# EAGLE design MRCS-RJ45-CMRI (EAGLE 7.7.0)
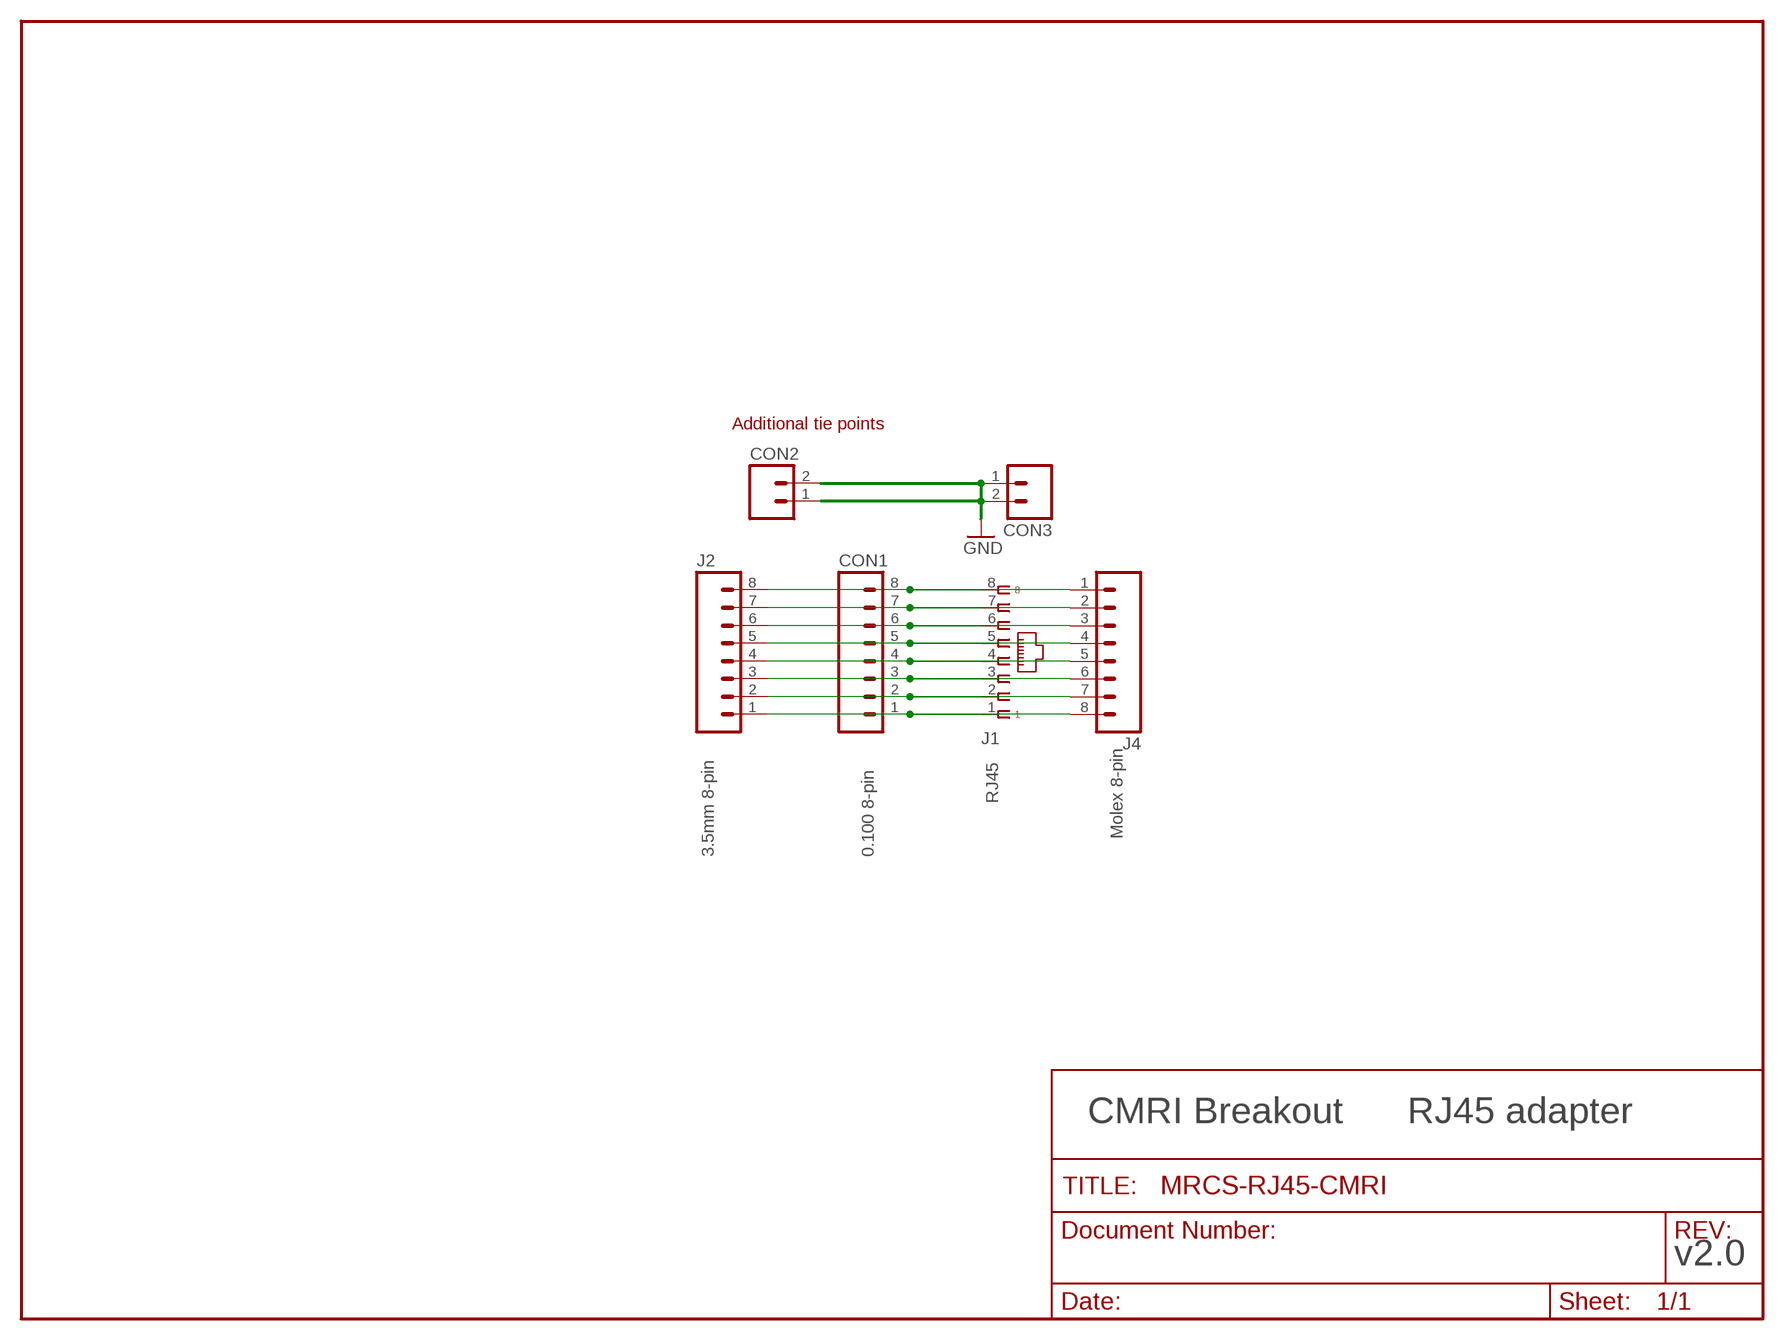
[diagram p0: schematic, sheet 1]

## Parts
CON1  CONNECTOR-M08LOCK  [1X08_LOCK]
CON2  CONNECTOR-M023.5MM-LOCK  [SCREWTERMINAL-3.5MM-2_LOCK]
CON3  CONNECTOR-M023.5MM-LOCK  [SCREWTERMINAL-3.5MM-2_LOCK]
J1  CONNECTOR-RJ45-FRONT  [RJ45-NO-SHIELD]
J2  CONNECTOR-M083.5MM-8  [SCREWTERMINAL-3.5MM-8]
J4  CONNECTOR-M081.56-F  [KK-156-8-F]

## Nets
GND: CON2.1(A) CON2.2(B) CON3.1(A) CON3.2(B)
L1: CON1.1 J1.1 J2.1 J4.8
L2: CON1.2 J1.2 J2.2 J4.7
L3: CON1.3 J1.3 J2.3 J4.6
L4: CON1.4 J1.4 J2.4 J4.5
L5: CON1.5 J1.5 J2.5 J4.4
L6: CON1.6 J1.6 J2.6 J4.3
L7: CON1.7 J1.7 J2.7 J4.2
L8: CON1.8 J1.8 J2.8 J4.1

## Notes on the sheet
- Additional tie points
- RJ45
- Molex 8-pin
- 3.5mm 8-pin | 0.100 8-pin
- CMRI Breakout | RJ45 adapter
- v2.0

## Library data of the parts
CON1 J2 J4 = SPCoast:CONNECTOR-M08: Header 8 Standard 8-pin 0.1" header. Use with straight break away headers (SKU : PRT-00116), right angle break away headers (PRT-00553), swiss pins (PRT-00743), machine pins (PRT-00117), and female headers (PRT-00115).
CON2 CON3 = SPCoast:CONNECTOR-M02: PHOENIX CONNECTOR
J1 = SPCoast:CONNECTOR-RJ45: Tyco CORCOM Modular RJ Jacks No Shield; AMP: 520151-4; OPL: none

## Net classes
0 default: width 0.508 mm

## Board
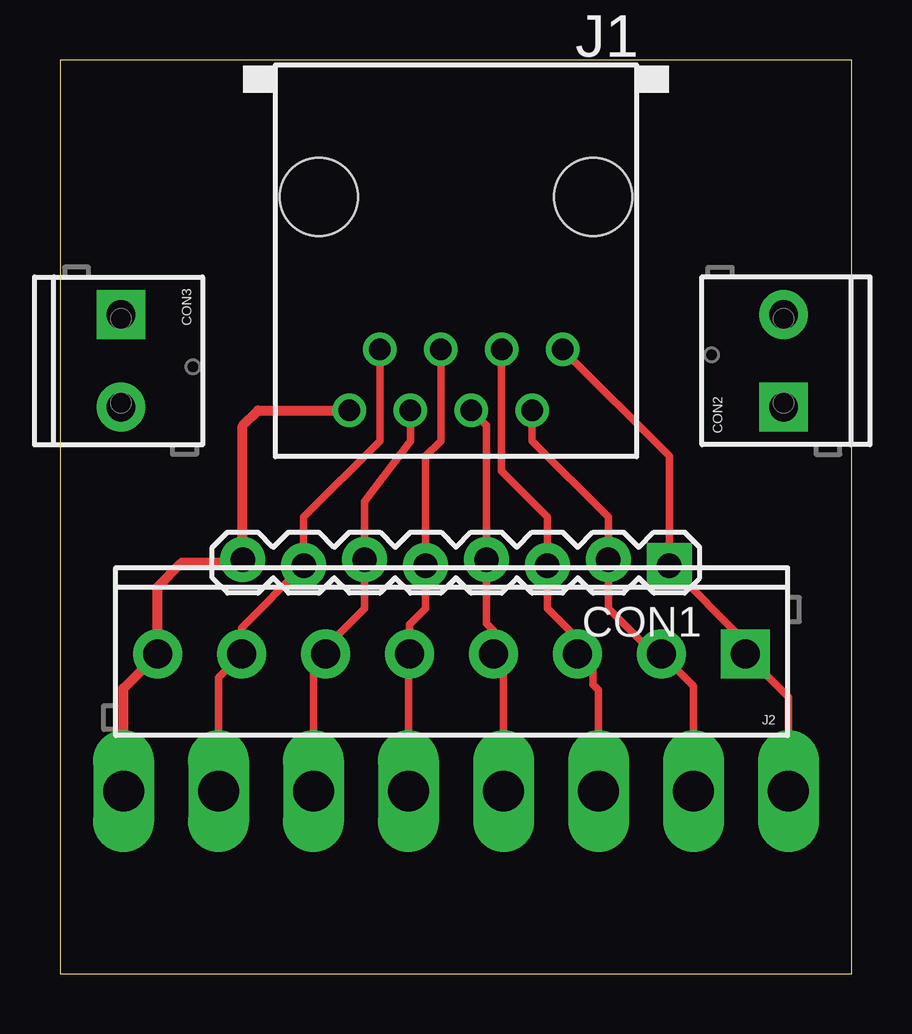
[diagram p1: board, top side]
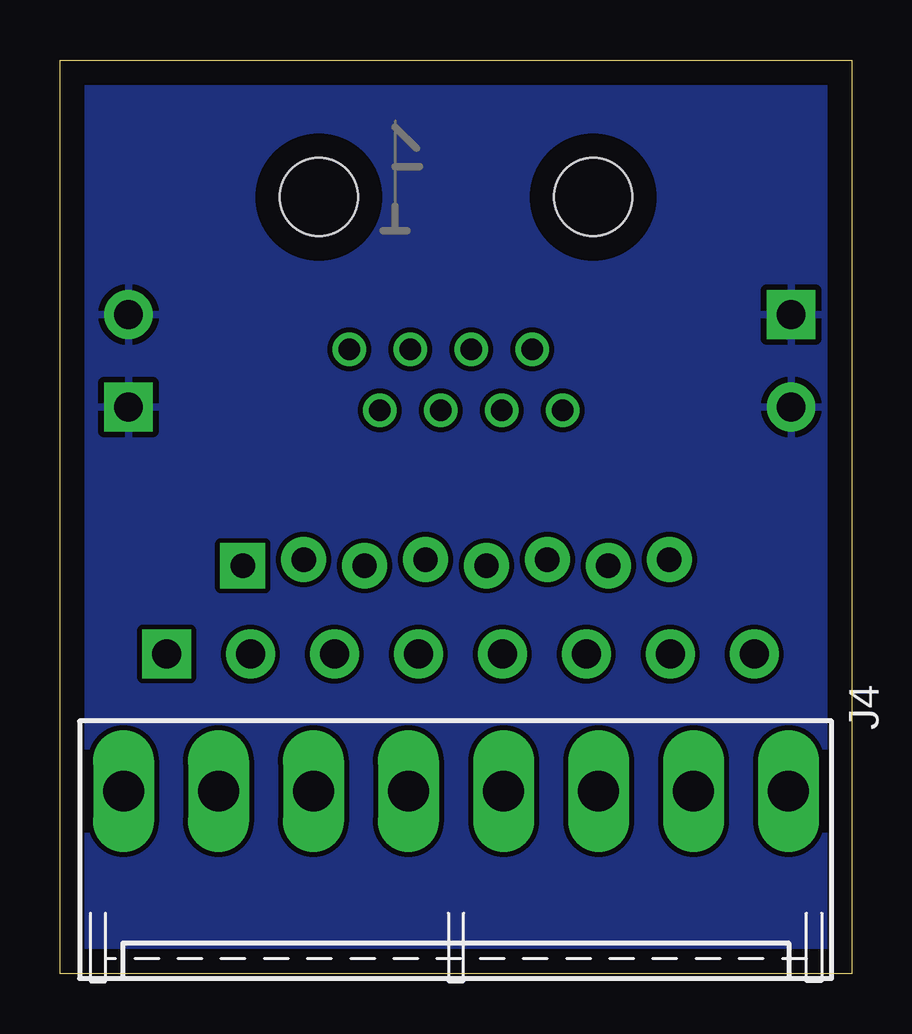
[diagram p2: board, bottom side, seen from below]

Size 33.02 x 38.1 mm. Coordinates in mm from the lower left corner, seen from the top.
Outline: 0,0 33,0 33.02,38.1 0,38.1 0,0
Copper layers (1*16): Top 0.035mm / dielectric 1.5mm / Bottom 0.035mm
Design rules "default": minimum track width 10mil, minimum drill 24mil, track to track 8mil, track to pad 8mil, pad to pad 8mil, via to via 8mil, smd to smd 8mil, copper to edge 40mil, drill to drill 8mil, minimum pad ring 10mil, minimum via ring 8mil, stop-mask expansion 4mil, vias tented up to drill 0mil, thermal gap 10mil

### Footprints (pad centres in the part's own frame; a part is rotated, then mirrored left to right if it is on the bottom)
1X08_LOCK = drill 1.016 pad 1.88 square: 1 0,0.127 | drill 1.016 pad 1.88: 2 2.54,-0.127; 3 5.08,0.127; 4 7.62,-0.127; 5 10.16,0.127; 6 12.7,-0.127; 7 15.24,0.127; 8 17.78,-0.127
SCREWTERMINAL-3.5MM-2_LOCK = drill 1.2 pad 2.032 square: 1 -0.178,0 | drill 1.2 pad 2.032: 2 3.678,0
RJ45-NO-SHIELD = drill 0.9 pad 1.4: 1 -4.445,6.35; 2 -3.175,8.89; 3 -1.905,6.35; 4 -0.635,8.89; 5 0.635,6.35; 6 1.905,8.89; 7 3.175,6.35; 8 4.445,8.89 | hole 3.251: -5.715,0; 5.715,0
SCREWTERMINAL-3.5MM-8 = drill 1.2 pad 2.032 square: 1 0,0 | drill 1.2 pad 2.032: 2 3.5,0; 3 7,0; 4 10.5,0; 5 14,0; 6 17.5,0; 7 21,0; 8 24.5,0
KK-156-8-F = drill 1.7 pad 2.184 long: 1 -13.86,0; 2 -9.9,0; 3 -5.94,0; 4 -1.98,0; 5 1.98,0; 6 5.94,0; 7 9.9,0; 8 13.86,0

### Placement (x,y rotation side)
CON1  25.4,17.14 180 top
CON2  30.16,23.81 90 top
CON3  2.54,27.3 270 top
J1  16.51,32.38 180 top
J2  28.57,13.34 180 top
J4  16.51,7.62 180 bottom
U$1  [MRCSLOGOBTM]  12.7,30.48 0 top

### Tracks (layer width: path | path; a pad name or v marks a point on that pad's centre or on a via)
GND
  pour Bottom: 0,0 33.02,0 33.02,38.1 0,38.1
L1
  Top 0.305: J4.8 30.37,11.54 J2.1 28.57,13.84 CON1.1 25.4,21.59 J1.1
L2
  Top 0.305: J4.7 26.41,12 J2.2 24.77,13.34 22.86,15.24 CON1.2 22.86,19.05 19.68,22.23 J1.2
L3
  Top 0.305: J4.6 22.45,11.84 22.23,12.06 22.23,12.69 J2.3 21.57,13.98 20.32,15.24 CON1.3 20.32,19.05 18.41,20.95 J1.3
L4
  Top 0.305: J4.5 18.49,12.92 J2.4 18.07,14.31 17.78,14.61 CON1.4 17.78,22.86 J1.4
L5
  Top 0.305: J4.4 14.53,13.29 J2.5 14.57,14.57 15.24,15.24 CON1.5 15.24,21.59 15.88,22.23 J1.5
L6
  Top 0.305: J4.3 10.57,12.83 J2.6 11.07,13.62 12.7,15.24 CON1.6 12.7,19.68 14.61,22.23 J1.6
L7
  Top 0.305: J4.2 6.61,12.37 J2.7 7.58,14.43 CON1.7 10.16,19.05 13.34,22.23 J1.7
L8
  Top 0.305: 11.43,23.5 J1.8
  Top 0.406: J4.1 2.65,11.91 J2.8 4.08,16.14 5.08,17.14 7.49,17.14 CON1.8 7.62,22.86 8.26,23.5 J1.8

### Text on the board
tDocu: GND | GND | CMRI-RJ | 2023.09